# Altium schematic sheet power.SchDoc: Power (part 1 of 2)
size A3; SheetNumber: 4; SheetTotal: 6
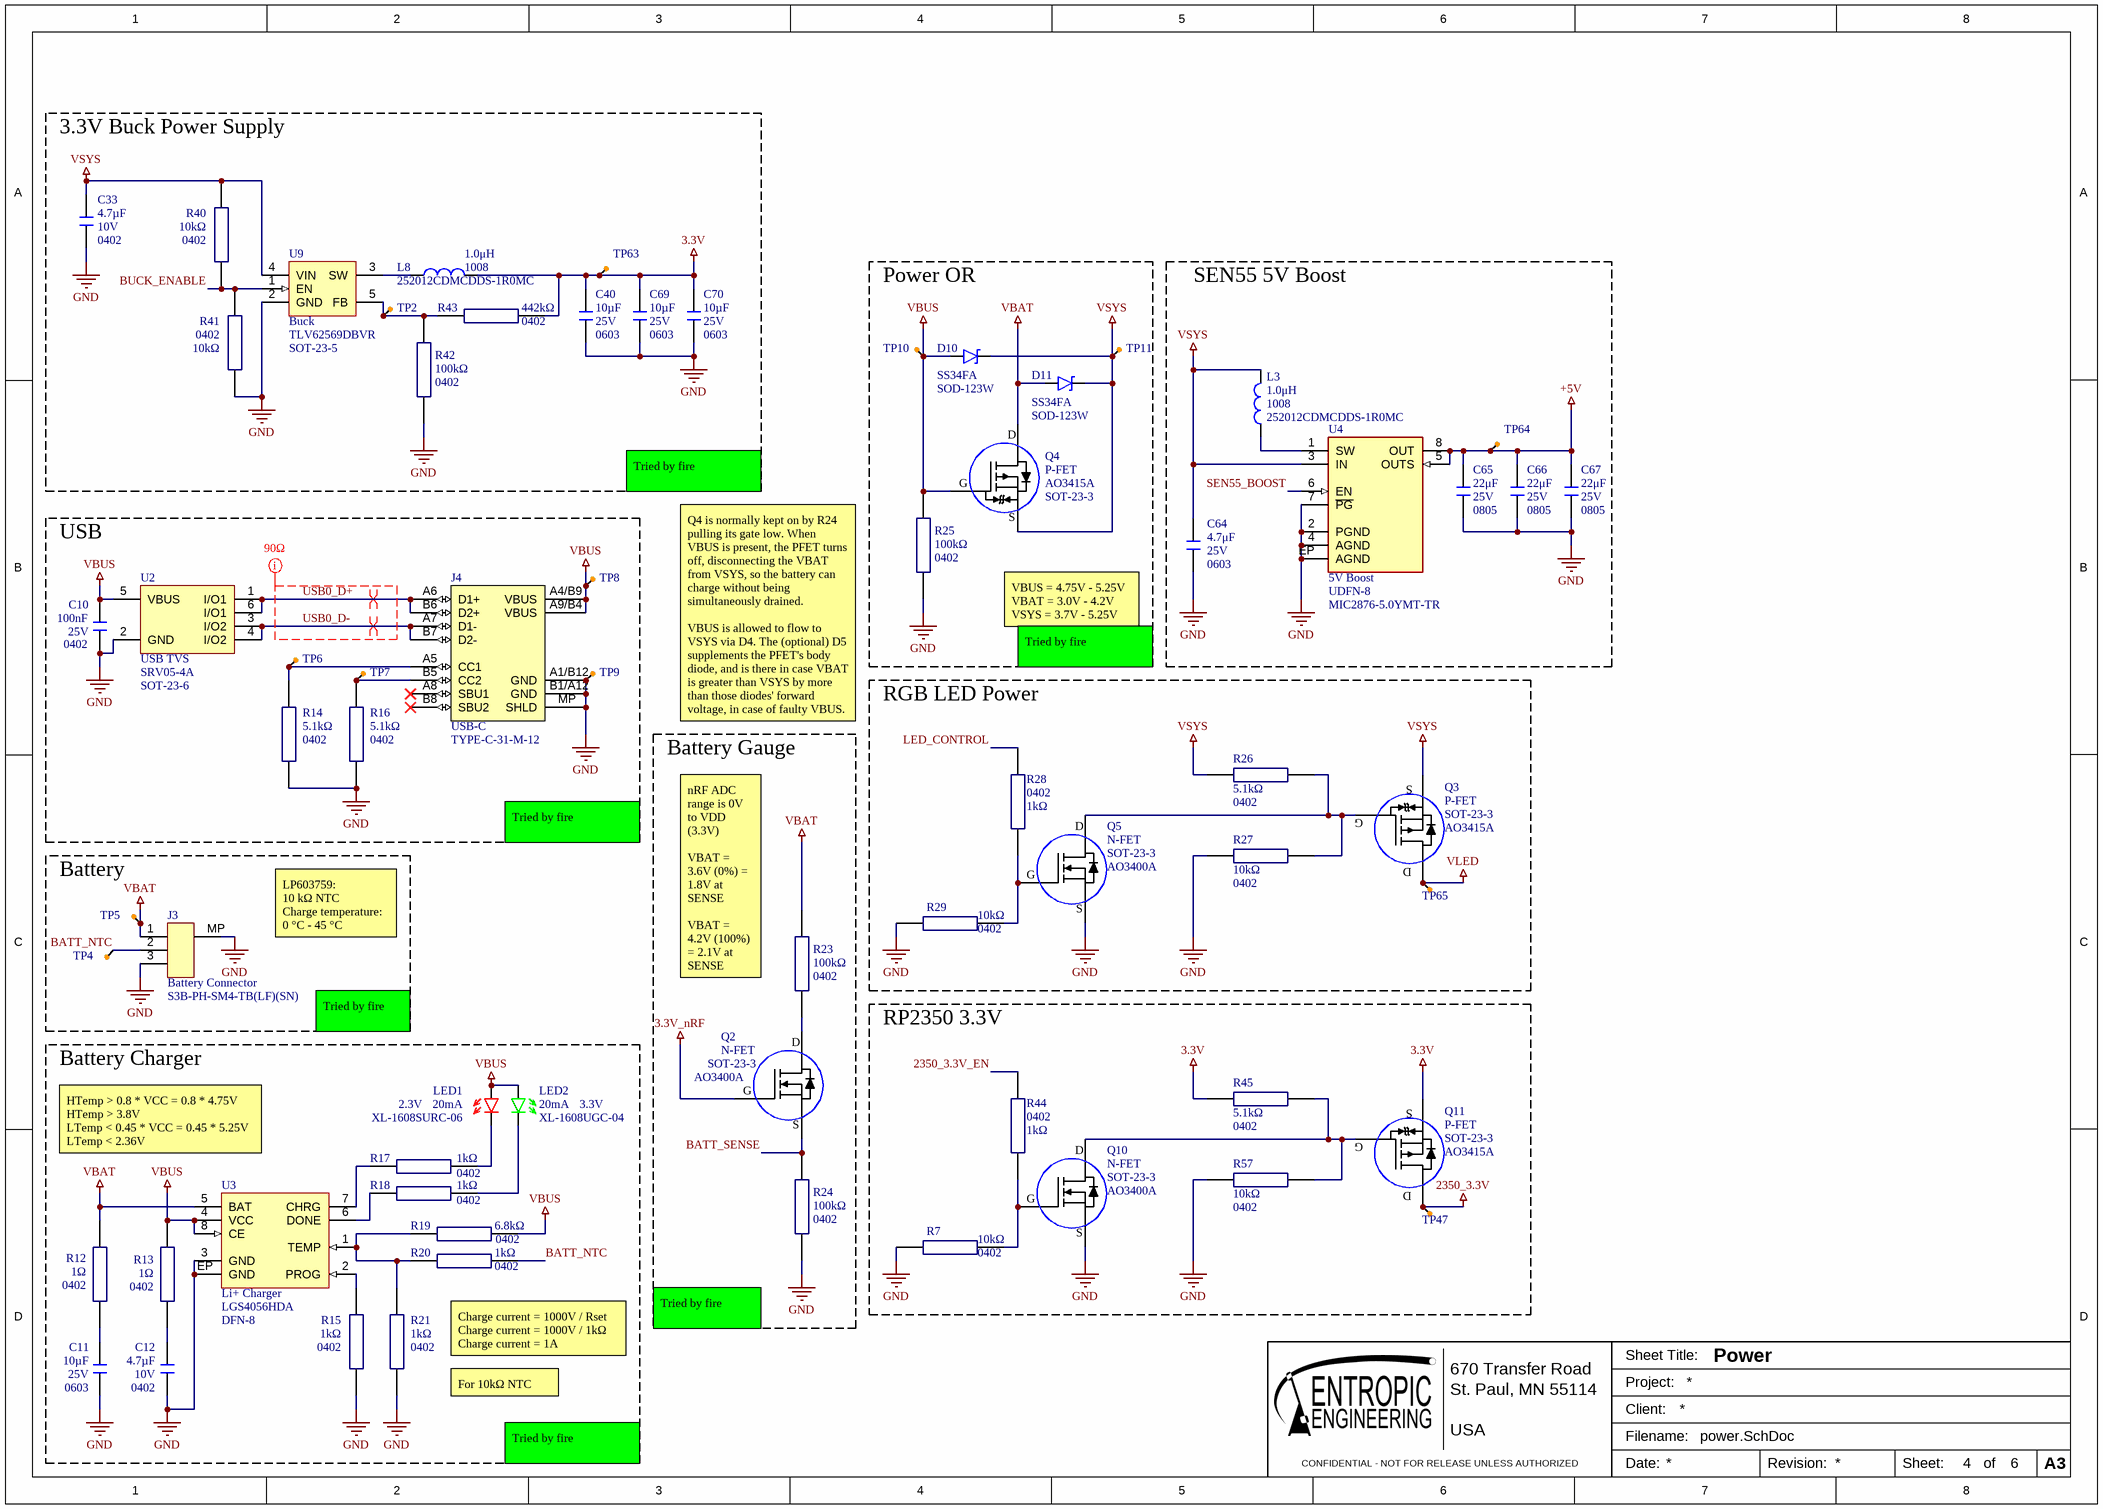
[diagram p0: power.SchDoc]

## Parts
C10  Case Code (Imperial): 0402  Voltage: 25V  Capacitance: 100nF  [0402_capacitor]  (hidden comment: GRM155R71E104KE14D)
C11  value 10µF  Case/Package: 0603  Voltage Rating: 25V  [0603_capacitor]  (hidden comment: CL10A106MA8NRNC)
C12  value 4.7µF  Voltage Rating: 10V  Case/Package: 0402  [0402_capacitor]  (hidden comment: CL05A475KP5NRNC)
C33  value 4.7µF  Voltage Rating: 10V  Case/Package: 0402  [0402_capacitor]  (hidden comment: CL05A475KP5NRNC)
C40  value 10µF  Case/Package: 0603  Voltage Rating: 25V  [0603_capacitor]  (hidden comment: CL10A106MA8NRNC)
C64  value 4.7μF  Case/Package: 0603  Voltage Rating: 25V  [0603_capacitor]  (hidden comment: C1608X5R1E475K080AC)
C65  value 22μF  Rated DC Voltage (URdc): 25V  Case/Package: 0805  [0805_capacitor]  (hidden comment: GRT21BR61E226ME13L)
C66  value 22μF  Rated DC Voltage (URdc): 25V  Case/Package: 0805  [0805_capacitor]  (hidden comment: GRT21BR61E226ME13L)
C67  value 22μF  Rated DC Voltage (URdc): 25V  Case/Package: 0805  [0805_capacitor]  (hidden comment: GRT21BR61E226ME13L)
C69  value 10µF  Case/Package: 0603  Voltage Rating: 25V  [0603_capacitor]  (hidden comment: CL10A106MA8NRNC)
C70  value 10µF  Case/Package: 0603  Voltage Rating: 25V  [0603_capacitor]  (hidden comment: CL10A106MA8NRNC)
D10  Case/Package: SOD-123W  [SOD-123]  (hidden comment: SS34FA)
D11  Case/Package: SOD-123W  [SOD-123]  (hidden comment: SS34FA)
J3  Battery Connector  [S3B-PH-SM4-TB]
J4  USB-C  Manufacturer Part Number: TYPE-C-31-M-12  [USB_C_2.0_M12]
L3  value 1.0μH  Package: 1008  [INDC2520X12N]  (hidden comment: 252012CDMCDDS-1R0MC)
L8  value 1.0μH  Package: 1008  [INDC2520X12N]  (hidden comment: 252012CDMCDDS-1R0MC)
LED1  Current: 20mA  Forward Voltage: 2.3V  [0603_DIODE]  (hidden comment: XL-1608SURC-06)
LED2  Current: 20mA  Forward Voltage: 3.3V  [0603_DIODE]  (hidden comment: XL-1608UGC-04)
Q2  N-FET  Case/Package: SOT-23-3  [SOT95P280X115-3N]
Q3  P-FET  Case/Package: SOT-23-3  [SOT95P280X115-3N]
Q4  P-FET  Case/Package: SOT-23-3  [SOT95P280X115-3N]
Q5  N-FET  Case/Package: SOT-23-3  [SOT95P280X115-3N]
Q10  N-FET  Case/Package: SOT-23-3  [SOT95P280X115-3N]
Q11  P-FET  Case/Package: SOT-23-3  [SOT95P280X115-3N]
R7  value 10kΩ  Case Code (Imperial): 0402  [0402_resistor]  (hidden comment: RC0402FR-0710KL)
R12  value 1Ω  Case/Package: 0402  [0402_resistor]  (hidden comment: 0402WGF100KTCE)
R13  value 1Ω  Case/Package: 0402  [0402_resistor]  (hidden comment: 0402WGF100KTCE)
R14  value 5.1kΩ  Case/Package: 0402  [0402_resistor]  (hidden comment: RC0402FR-075K1L)
R15  value 1kΩ  Case/Package: 0402  [0402_resistor]  (hidden comment: Rset)
R16  value 5.1kΩ  Case/Package: 0402  [0402_resistor]  (hidden comment: RC0402FR-075K1L)
R17  value 1kΩ  Case/Package: 0402  [0402_resistor]  (hidden comment: RC0402JR-071KL)
R18  value 1kΩ  Case/Package: 0402  [0402_resistor]  (hidden comment: RC0402JR-071KL)
R19  value 6.8kΩ  Case/Package: 0402  [0402_resistor]  (hidden comment: RC0402FR-076K8L)
R20  value 1kΩ  Case/Package: 0402  [0402_resistor]  (hidden comment: RC0402JR-071KL)
R21  value 1kΩ  Case/Package: 0402  [0402_resistor]  (hidden comment: Rset)
R23  value 100kΩ  Case/Package: 0402  [0402_resistor]  (hidden comment: RC0402FR-07100KL)
R24  value 100kΩ  Case/Package: 0402  [0402_resistor]  (hidden comment: RC0402FR-07100KL)
R25  value 100kΩ  Case/Package: 0402  [0402_resistor]  (hidden comment: RC0402FR-07100KL)
R26  value 5.1kΩ  Case/Package: 0402  [0402_resistor]  (hidden comment: RC0402FR-075K1L)
R27  value 10kΩ  Case Code (Imperial): 0402  [0402_resistor]  (hidden comment: RC0402FR-0710KL)
R28  value 1kΩ  Case/Package: 0402  [0402_resistor]  (hidden comment: RC0402JR-071KL)
R29  value 10kΩ  Case Code (Imperial): 0402  [0402_resistor]  (hidden comment: RC0402FR-0710KL)
R40  value 10kΩ  Case Code (Imperial): 0402  [0402_resistor]  (hidden comment: RC0402FR-0710KL)
R41  value 10kΩ  Case Code (Imperial): 0402  [0402_resistor]  (hidden comment: RC0402FR-0710KL)
R42  value 100kΩ  Case/Package: 0402  [0402_resistor]  (hidden comment: RC0402FR-07100KL)
R43  value 442kΩ  Case/Package: 0402  [0402_resistor]  (hidden comment: RC0402FR-07442KL)
R44  value 1kΩ  Case/Package: 0402  [0402_resistor]  (hidden comment: RC0402JR-071KL)
R45  value 5.1kΩ  Case/Package: 0402  [0402_resistor]  (hidden comment: RC0402FR-075K1L)
R57  value 10kΩ  Case Code (Imperial): 0402  [0402_resistor]  (hidden comment: RC0402FR-0710KL)
TP2  test_point-1  [test_point-1]  (value not drawn)  (no BOM)
TP4  test_point-1  [test_point-1]  (value not drawn)  (no BOM)
TP5  VBAT  [test_point-1]  (value not drawn)  (no BOM)
TP6  test_point-1  [test_point-1]  (value not drawn)  (no BOM)
TP7  test_point-1  [test_point-1]  (value not drawn)  (no BOM)
TP8  VBUS  [test_point-1]  (value not drawn)  (no BOM)
TP9  GND  [test_point-1]  (value not drawn)  (no BOM)
TP10  VBUS  [test_point-1]  (value not drawn)  (no BOM)
TP11  VSYS  [test_point-1]  (value not drawn)  (no BOM)
TP47  VLED  [test_point-1]  (value not drawn)  (no BOM)
TP63  Main 3.3V  [test_point-1]  (value not drawn)  (no BOM)
TP64  Sensors 5V  [test_point-1]  (value not drawn)  (no BOM)
TP65  VLED  [test_point-1]  (value not drawn)  (no BOM)
U2  USB TVS  Case/Package: SOT-23-6  [SOT95P280X110-6N]
U3  Li+ Charger  Manufacturer Part Number: LGS4056HDA  Package: DFN-8  [SON50P200X80_HS-9N]
U4  5V Boost  Case/Package: UDFN-8  [SON50P200X50_HS-9N]
U9  Buck  Case/Package: SOT-23-5  [SOT95P280X115-5N]

## Blocks framed on the sheet
3.3V Buck Power Supply: C33 C40 C69 C70 L8 R40-R43 TP2 TP63 U9
Power OR: D10 D11 Q4 R25 TP10 TP11
SEN55 5V Boost: C64-C67 L3 TP64 U4
USB: C10 J4 R14 R16 TP6-TP9 U2
RGB LED Power: Q3 Q5 R26-R29 TP65
Battery Gauge: Q2 R23 R24
Battery: J3 TP4 TP5
RP2350 3.3V: Q10 Q11 R7 R44 R45 R57 TP47
Battery Charger: C11 C12 LED1 LED2 R12 R13 R15 R17-R21 U3

## Nets
3.3V: C40.2 C69.2 C70.2 L8.2 Q11.2(S) R43.2 R45.2 TP63.1
3.3V_nRF: Q2.1(G)
2350_3.3V: Q11.3(D) TP47.1
+5V: C65.2 C66.2 C67.2 TP64.1 U4.5(OUTS) U4.8(OUT)
GND: C10.1 C11.1 C12.1 C33.1 C40.1 C64.1 C65.1 C66.1 C67.1 C69.1 C70.1 J3.3 J3.MP J4.A1/B12(GND) J4.B1/A12(GND) J4.MP(SHLD) Q5.2(S) Q10.2(S) R7.2 R14.1 R15.1 R16.1 R21.1 R24.1 R25.1 R27.2 R29.2 R41.1 R42.1 R57.2 TP9.1 U2.2(GND) U3.3(GND) U3.EP(GND) U4.2(PGND) U4.4(AGND) U4.7(~{PG}) U4.EP(AGND) U9.2(GND)
VBAT: D11.A J3.1 Q4.3(D) R12.2 R23.2 TP5.1 U3.5(BAT)
VBUS: C10.2 D10.A J4.A4/B9(VBUS) J4.A9/B4(VBUS) LED1.2 LED2.2 Q4.1(G) R13.2 R19.1 R25.2 TP8.1 TP10.1 U2.5(VBUS) U3.4(VCC) U3.8(CE)
VLED: Q3.3(D) TP65.1
VSYS: C33.2 C64.2 D10.K D11.K L3.1 Q3.2(S) Q4.2(S) R26.2 R40.2 TP11.1 U4.3(IN) U9.4(VIN)
2350_3.3V_EN: R44.1
BATT_NTC: J3.2 R20.1 TP4.1
BATT_SENSE: Q2.2(S) R24.2
BUCK_ENABLE: R40.1 R41.2 U9.1(EN)
LED_CONTROL: R28.1
SEN55_BOOST: U4.6(EN)
USB0_D+: J4.A6(D1+) J4.B6(D2+) U2.1(I/O1) U2.6(I/O1)
USB0_D-: J4.A7(D1-) J4.B7(D2-) U2.3(I/O2) U2.4(I/O2)
NetC11_2: C11.2 R12.1
NetC12_2: C12.2 R13.1
NetJ4_A5: J4.A5(CC1) R14.2 TP6.1
NetJ4_B5: J4.B5(CC2) R16.2 TP7.1
NetL3_2: L3.2 U4.1(SW)
NetL8_1: L8.1 U9.3(SW)
NetLED1_1: LED1.1 R17.1
NetLED2_1: LED2.1 R18.1
NetQ2_3: Q2.3(D) R23.1
NetQ3_1: Q3.1(G) Q5.3(D) R26.1 R27.1
NetQ5_1: Q5.1(G) R28.2 R29.1
NetQ10_1: Q10.1(G) R7.1 R44.2
NetQ10_3: Q10.3(D) Q11.1(G) R45.1 R57.1
NetR15_2: R15.2 U3.2(PROG)
NetR17_2: R17.2 U3.7(CHRG)
NetR18_2: R18.2 U3.6(DONE)
NetR19_2: R19.2 R20.2 R21.2 U3.1(TEMP)
NetR42_2: R42.2 R43.1 TP2.1 U9.5(FB)

Not connected (* = marked no-connect by the designer): J4 A8(SBU1)* B8(SBU2)*

## Layout directives
net class 90_OHM: USB0_D+, USB0_D-
differential pair; differential pair class USB_DIFF: USB0_D+, USB0_D-

## Notes on the sheet
- Tried by fire
- VBUS = 4.75V - 5.25V
  VBAT = 3.0V - 4.2V
  VSYS = 3.7V - 5.25V
- Q4 is normally kept on by R24 pulling its gate low. When VBUS is present, the PFET turns off, disconnecting the VBAT from VSYS, so the battery can charge without being simultaneously drained.
  VBUS is allowed to flow to VSYS via D4. The (optional) D5 supplements the PFET's body diode, and is there in case VBAT is greater than VSYS by more than those diodes' forward voltage, in case of faulty VBUS.
- LP603759:
  10 kΩ NTC
  Charge temperature:
  0 °C - 45 °C
- (near R23) nRF ADC range is 0V to VDD (3.3V)
  VBAT = 3.6V (0%) = 1.8V at SENSE
  VBAT = 4.2V (100%) = 2.1V at SENSE
- HTemp > 0.8 * VCC = 0.8 * 4.75V
  HTemp > 3.8V
  LTemp < 0.45 * VCC = 0.45 * 5.25V
  LTemp < 2.36V
- For 10kΩ NTC
- Charge current = 1000V / Rset
  Charge current = 1000V / 1kΩ
  Charge current = 1A
- 670 Transfer Road
- St. Paul, MN 55114
- Sheet Title:
- Project:
- CONFIDENTIAL - NOT FOR RELEASE UNLESS AUTHORIZED
- USA
- Client:
- Filename:
- Date:
- Revision:
- Sheet:
- of
- A3